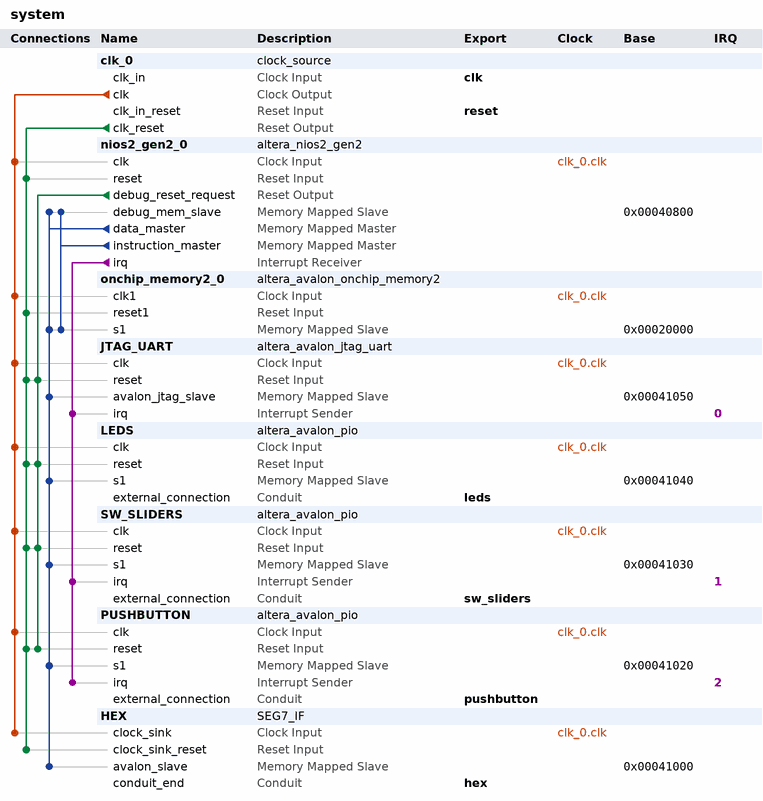
[diagram p0: system contents]
# Platform Designer (Qsys) system system, Cyclone V 5CEBA2F17A7
# Parameters at their usual value, and those the tool derives, are not listed.
package require -exact qsys 17.1
create_system system
set_project_property DEVICE_FAMILY {Cyclone V}
set_project_property DEVICE 5CEBA2F17A7

add_instance clk_0 clock_source 17.1
set_instance_parameter_value clk_0 clockFrequency 50000000

add_instance nios2_gen2_0 altera_nios2_gen2 17.1
set_instance_parameter_value nios2_gen2_0 dcache_size 2048
set_instance_parameter_value nios2_gen2_0 exceptionSlave onchip_memory2_0.s1
set_instance_parameter_value nios2_gen2_0 icache_size 4096
set_instance_parameter_value nios2_gen2_0 impl Tiny
set_instance_parameter_value nios2_gen2_0 resetSlave onchip_memory2_0.s1

add_instance onchip_memory2_0 altera_avalon_onchip_memory2 17.1
set_instance_parameter_value onchip_memory2_0 dataWidth 32
set_instance_parameter_value onchip_memory2_0 dualPort false
set_instance_parameter_value onchip_memory2_0 initMemContent true
set_instance_parameter_value onchip_memory2_0 initializationFileName onchip_mem.hex
set_instance_parameter_value onchip_memory2_0 memorySize 128000

add_instance JTAG_UART altera_avalon_jtag_uart 17.1
set_instance_parameter_value JTAG_UART simInteractiveOptions NO_INTERACTIVE_WINDOWS

add_instance LEDS altera_avalon_pio 17.1
set_instance_parameter_value LEDS direction Output
set_instance_parameter_value LEDS width 10

add_instance SW_SLIDERS altera_avalon_pio 17.1
set_instance_parameter_value SW_SLIDERS bitClearingEdgeCapReg true
set_instance_parameter_value SW_SLIDERS captureEdge true
set_instance_parameter_value SW_SLIDERS direction Input
set_instance_parameter_value SW_SLIDERS generateIRQ true
set_instance_parameter_value SW_SLIDERS irqType EDGE
set_instance_parameter_value SW_SLIDERS width 10

add_instance PUSHBUTTON altera_avalon_pio 17.1
set_instance_parameter_value PUSHBUTTON bitClearingEdgeCapReg true
set_instance_parameter_value PUSHBUTTON captureEdge true
set_instance_parameter_value PUSHBUTTON direction Input
set_instance_parameter_value PUSHBUTTON generateIRQ true
set_instance_parameter_value PUSHBUTTON irqType EDGE
set_instance_parameter_value PUSHBUTTON width 4

add_instance HEX SEG7_IF 1.0
set_instance_parameter_value HEX SEG7_NUM 6

# connections
add_connection clk_0.clk HEX.clock_sink clock
add_connection clk_0.clk JTAG_UART.clk clock
add_connection clk_0.clk LEDS.clk clock
add_connection clk_0.clk nios2_gen2_0.clk clock
add_connection clk_0.clk onchip_memory2_0.clk1 clock
add_connection clk_0.clk PUSHBUTTON.clk clock
add_connection clk_0.clk SW_SLIDERS.clk clock
add_connection clk_0.clk_reset HEX.clock_sink_reset reset
add_connection clk_0.clk_reset JTAG_UART.reset reset
add_connection clk_0.clk_reset LEDS.reset reset
add_connection clk_0.clk_reset nios2_gen2_0.reset reset
add_connection clk_0.clk_reset onchip_memory2_0.reset1 reset
add_connection clk_0.clk_reset PUSHBUTTON.reset reset
add_connection clk_0.clk_reset SW_SLIDERS.reset reset
add_connection nios2_gen2_0.debug_reset_request JTAG_UART.reset reset
add_connection nios2_gen2_0.debug_reset_request LEDS.reset reset
add_connection nios2_gen2_0.debug_reset_request PUSHBUTTON.reset reset
add_connection nios2_gen2_0.debug_reset_request SW_SLIDERS.reset reset
add_connection nios2_gen2_0.data_master HEX.avalon_slave avalon
set_connection_parameter_value nios2_gen2_0.data_master/HEX.avalon_slave baseAddress 0x00041000
add_connection nios2_gen2_0.data_master JTAG_UART.avalon_jtag_slave avalon
set_connection_parameter_value nios2_gen2_0.data_master/JTAG_UART.avalon_jtag_slave baseAddress 0x00041050
add_connection nios2_gen2_0.data_master LEDS.s1 avalon
set_connection_parameter_value nios2_gen2_0.data_master/LEDS.s1 baseAddress 0x00041040
add_connection nios2_gen2_0.data_master nios2_gen2_0.debug_mem_slave avalon
set_connection_parameter_value nios2_gen2_0.data_master/nios2_gen2_0.debug_mem_slave baseAddress 0x00040800
add_connection nios2_gen2_0.data_master onchip_memory2_0.s1 avalon
set_connection_parameter_value nios2_gen2_0.data_master/onchip_memory2_0.s1 baseAddress 0x00020000
add_connection nios2_gen2_0.data_master PUSHBUTTON.s1 avalon
set_connection_parameter_value nios2_gen2_0.data_master/PUSHBUTTON.s1 baseAddress 0x00041020
add_connection nios2_gen2_0.data_master SW_SLIDERS.s1 avalon
set_connection_parameter_value nios2_gen2_0.data_master/SW_SLIDERS.s1 baseAddress 0x00041030
add_connection nios2_gen2_0.instruction_master nios2_gen2_0.debug_mem_slave avalon
set_connection_parameter_value nios2_gen2_0.instruction_master/nios2_gen2_0.debug_mem_slave baseAddress 0x00040800
add_connection nios2_gen2_0.instruction_master onchip_memory2_0.s1 avalon
set_connection_parameter_value nios2_gen2_0.instruction_master/onchip_memory2_0.s1 baseAddress 0x00020000
add_connection nios2_gen2_0.irq JTAG_UART.irq interrupt
set_connection_parameter_value nios2_gen2_0.irq/JTAG_UART.irq irqNumber 0
add_connection nios2_gen2_0.irq PUSHBUTTON.irq interrupt
set_connection_parameter_value nios2_gen2_0.irq/PUSHBUTTON.irq irqNumber 2
add_connection nios2_gen2_0.irq SW_SLIDERS.irq interrupt
set_connection_parameter_value nios2_gen2_0.irq/SW_SLIDERS.irq irqNumber 1

# exported interfaces
add_interface clk clock sink
set_interface_property clk EXPORT_OF clk_0.clk_in
add_interface hex conduit end
set_interface_property hex EXPORT_OF HEX.conduit_end
add_interface leds conduit end
set_interface_property leds EXPORT_OF LEDS.external_connection
add_interface pushbutton conduit end
set_interface_property pushbutton EXPORT_OF PUSHBUTTON.external_connection
add_interface reset reset sink
set_interface_property reset EXPORT_OF clk_0.clk_in_reset
add_interface sw_sliders conduit end
set_interface_property sw_sliders EXPORT_OF SW_SLIDERS.external_connection

set_interconnect_requirement {$system} qsys_mm.clockCrossingAdapter HANDSHAKE
set_interconnect_requirement {$system} qsys_mm.enableEccProtection FALSE
set_interconnect_requirement {$system} qsys_mm.insertDefaultSlave FALSE
set_interconnect_requirement {$system} qsys_mm.maxAdditionalLatency 1

save_system system.qsys
